# Altium schematic sheet CW340_Cover_Page.SchDoc: Luna Board - The Cover Sheet
size Letter; DocumentNumber: .; Revision: .; SheetNumber: 1; SheetTotal: 31; SheetApproved: Yes
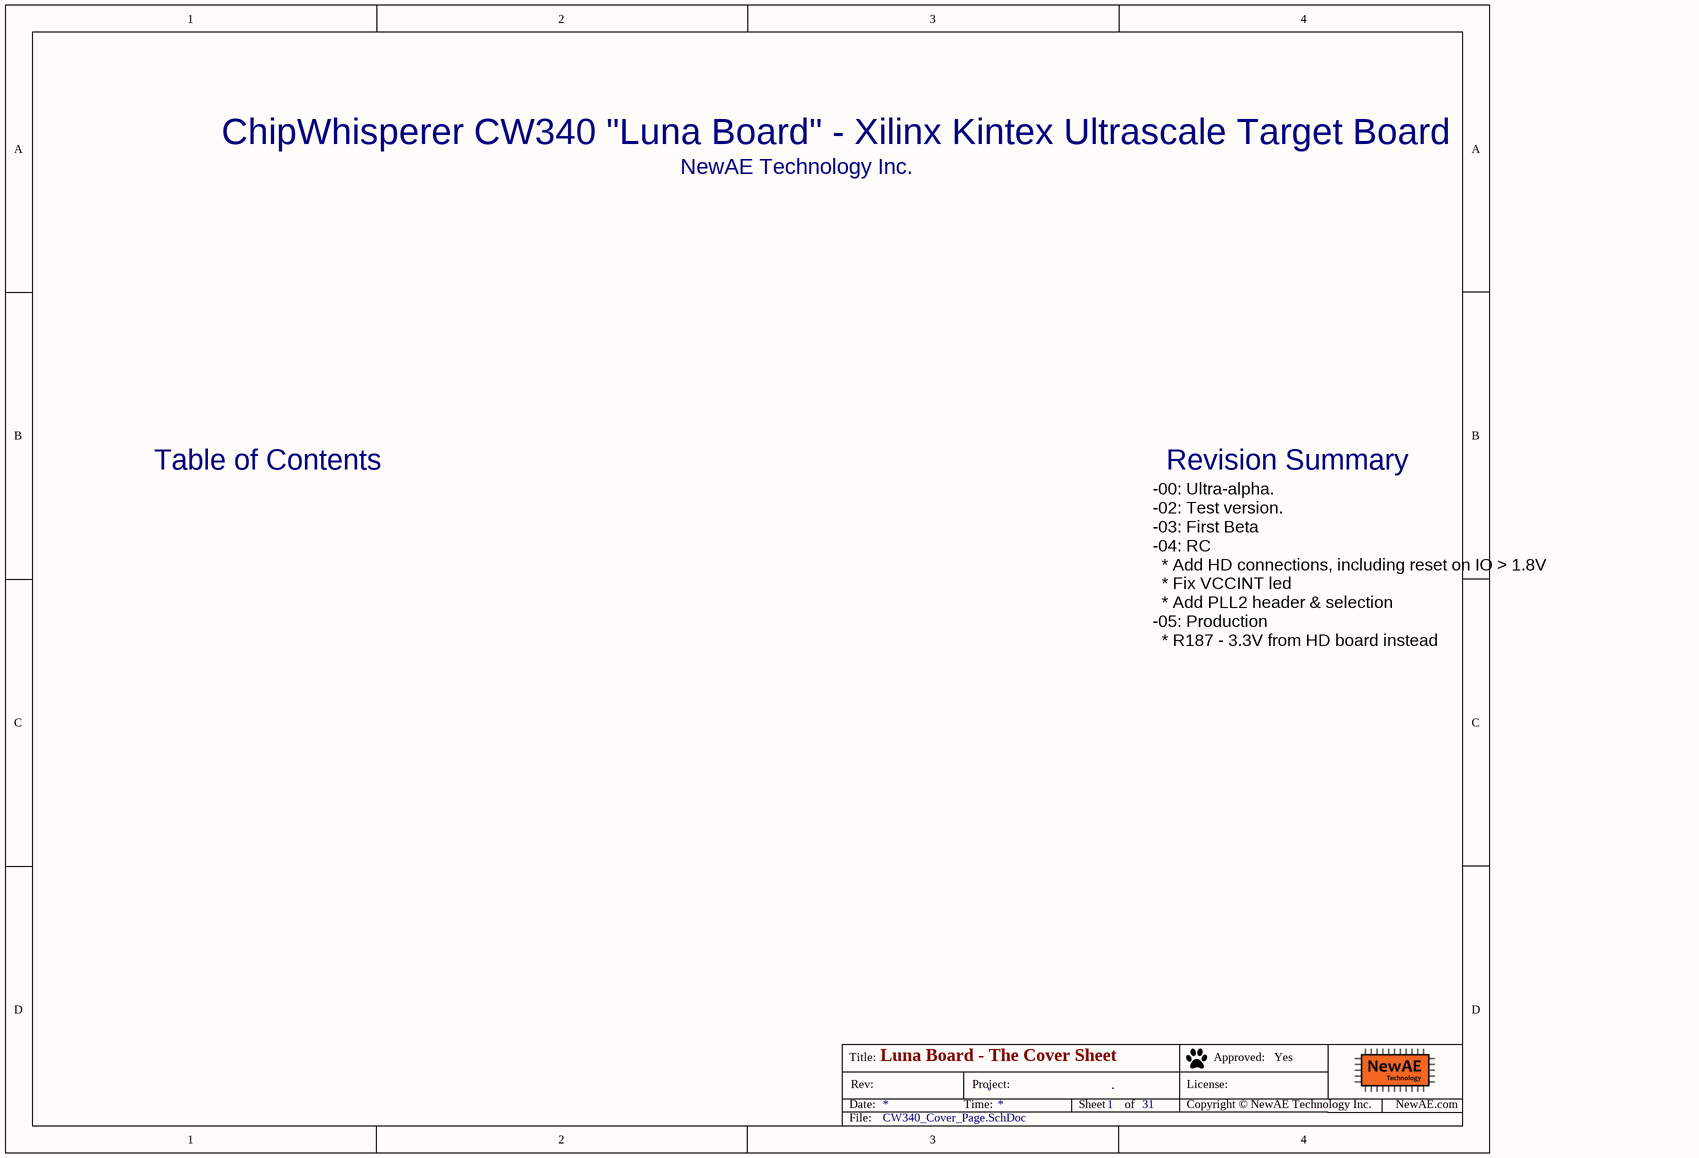
[diagram p0: CW340_Cover_Page.SchDoc]

## Notes on the sheet
- ChipWhisperer CW340 "Luna Board" - Xilinx Kintex Ultrascale Target Board
- NewAE Technology Inc.
- Table of Contents
- Revision Summary
- -00: Ultra-alpha.
  -02: Test version.
  -03: First Beta
  -04: RC
  * Add HD connections, including reset on IO > 1.8V
  * Fix VCCINT led
  * Add PLL2 header & selection
  -05: Production
  * R187 - 3.3V from HD board instead
- Title:
- Date:
- Rev:
- Time:
- Project:
- Sheet
- of
- License:
- Copyright © NewAE Technology Inc.
- Approved:
- NewAE.com
- File: